# EasyEDA schematic CHARGE MONITORING CIRCUIT.json
TITLE: BATTERY CHARGE MONITORING SYSTEM; REV: 1.0; Date: 2024-02-06; Sheet: 1/1; Drawn By: magambomaurice93; Company: FINALYEAR PROJECT
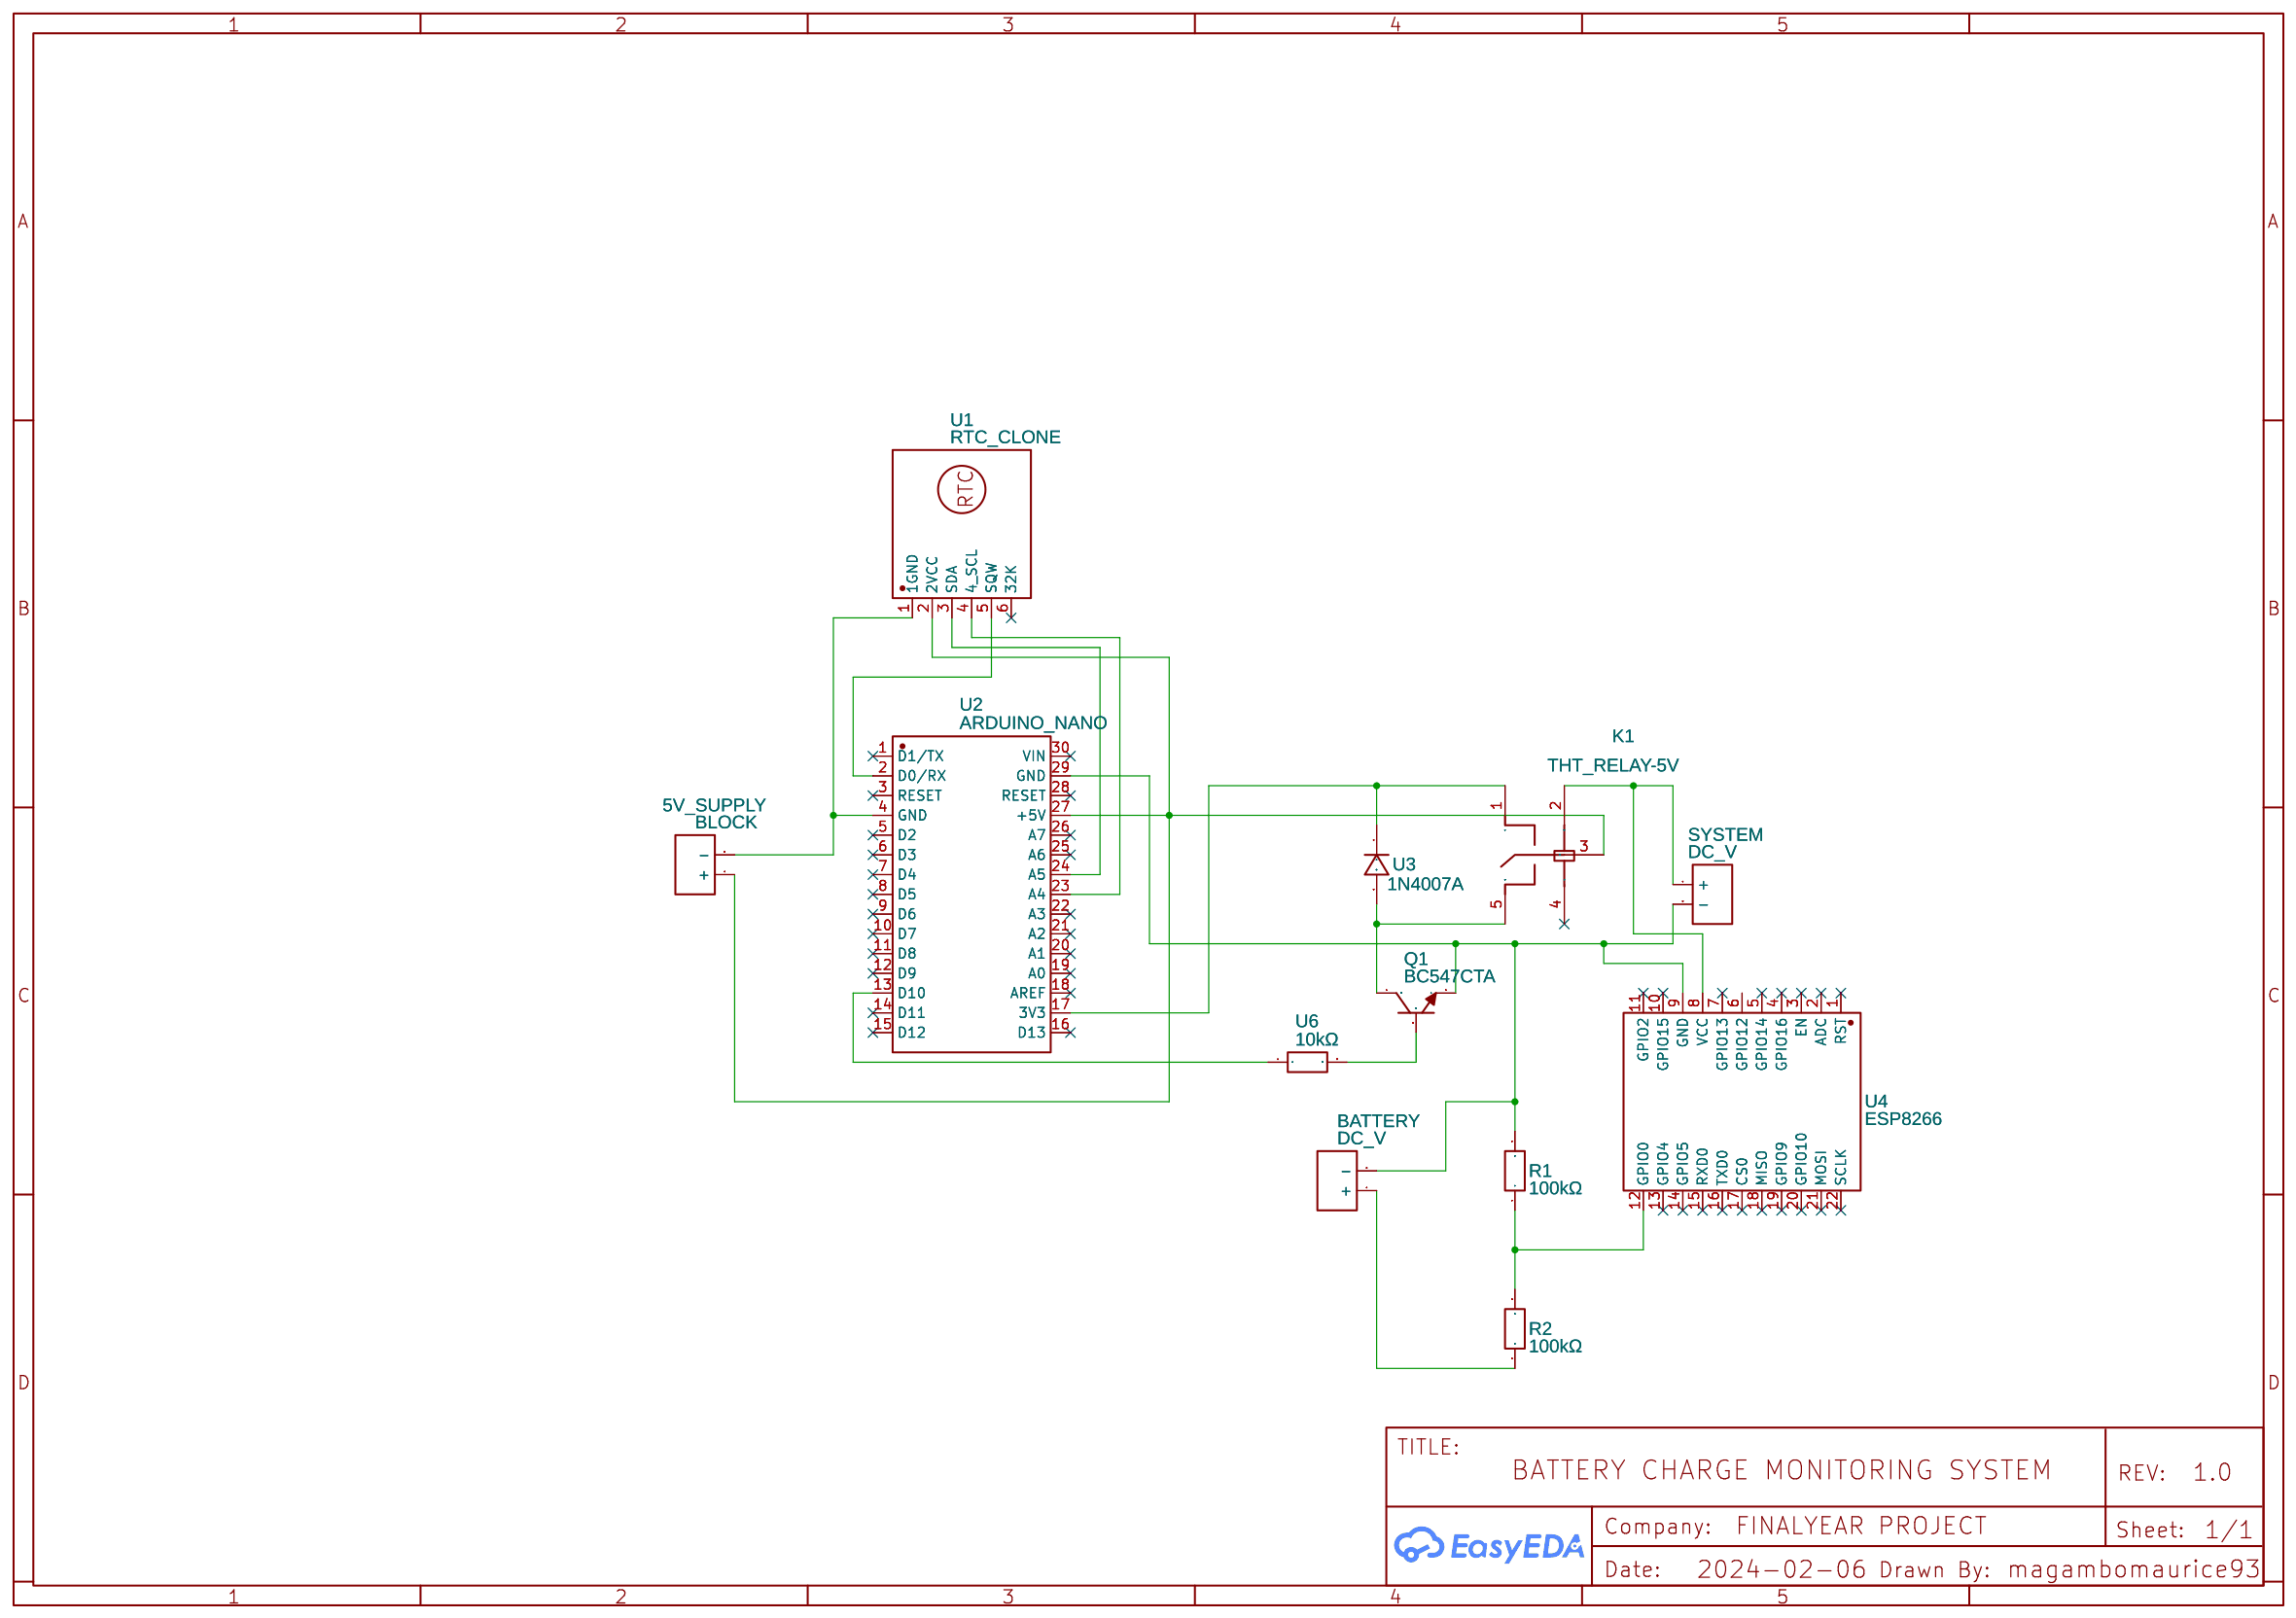
[diagram p0: schematic sheet]

## Parts
5V_SUPPLY  BLOCK  [BORNERA DOS TERMINALES TERMINAL BLOCK 5MM]
BATTERY  DC_V  [BORNERA DOS TERMINALES TERMINAL BLOCK 5MM]
K1  THT_RELAY-5V  [RELAY-TH_RELAY-SPST]
Q1  BC547CTA  [TO-92-3_L4.8-W3.7-P2.54-L]
R1  100kΩ  [RES-TH_BD2.4-L6.3-P10.30-D0.6]
R2  100kΩ  [RES-TH_BD2.4-L6.3-P10.30-D0.6]
SYSTEM  DC_V  [BORNERA DOS TERMINALES TERMINAL BLOCK 5MM]
U1  RTC_CLONE  [RTC3231]
U2  ARDUINO_NANO  [COMM-TH_ARDUINO_NANO]
U3  1N4007A  [DO-41_BD2.4-L4.7-P8.70-D0.9-RD]
U4  ESP8266  [WIFIM-SMD_ESP-12F-ESP8266MOD]
U6  10kΩ  [RES-TH_BD2.4-L6.3-P10.30-D0.6]

## Library data of the parts
5V_SUPPLY BATTERY SYSTEM = DC_V: Contributor: omabistudio
K1 = THT_RELAY-SPST_5V: Supplier: LCSC; Supplier Part: C2941249; Manufacturer: null; Manufacturer Part: Relay-SPST; JLCPCB Part Class: Extended Part; Contributor: aryatama22trm
Q1 = BC547CTA: Contributor: LCSC; Supplier: LCSC; Supplier Part: C900799; Manufacturer: onsemi(安森美); JLCPCB Part Class: Extended Part
R1 R2 = RNF14FAE100K: Contributor: lcsc; Supplier: LCSC; Supplier Part: C2644165; Manufacturer: SEI(Stackpole Electronics Inc.)
U1 = RTC_CLONE: Contributor: James2
U2 = ARDUINO_NANO: Contributor: lcsc; Supplier: LCSC; Supplier Part: C9900017879; Manufacturer: null; JLCPCB Part Class: Extended Part
U3 = 1N4007A: Contributor: lcsc; Supplier: LCSC; Supplier Part: C5336145; Manufacturer: LRC(乐山无线电)
U4 = ESP8266: LINK: https://img.jlc.com/image//data/smt-stock-produce/componentSizePhoto/2021-12-02/b5eb61357b2a478295008aee8c894ebd/BG2111290693_D21112900056_font.png; Contributor: LCSC; Supplier: LCSC; Supplier Part: C9900003049; Manufacturer: null; JLCPCB Part Class: Extended Part
U6 = FM0207FTE52-10K: Contributor: lcsc; Supplier: LCSC; Supplier Part: C1377488; Manufacturer: YAGEO(国巨); JLCPCB Part Class: Extended Part

## Nets
Net-(5V_SUPPLY-1): 5V_SUPPLY.1(+) K1.3 U1.2(2VCC) U2.27(+5V)
Net-(5V_SUPPLY-2): 5V_SUPPLY.2(-) U1.1(1GND) U2.4(GND)
Net-(BATTERY-1): BATTERY.1(+) R2.1
Net-(BATTERY-2): BATTERY.2(-) Q1.3(E) R1.2 SYSTEM.2(-) U2.29(GND) U4.9(GND)
Net-(K1-1): K1.1 U2.17(3V3) U3.1
Net-(K1-2): K1.2 SYSTEM.1(+) U4.8(VCC)
Net-(K1-5): K1.5 Q1.1(C) U3.2
Net-(Q1-2): Q1.2(B) U6.2
Net-(R1-1): R1.1 R2.2 U4.12(GPIO0)
Net-(U1-3): U1.3(SDA) U2.24(A5)
Net-(U1-4): U1.4(4 SCL) U2.23(A4)
Net-(U1-5): U1.5(SQW) U2.2(D0/RX)
Net-(U2-13): U2.13(D10) U6.1

Not connected (* = marked no-connect by the designer): K1 4*; U1 6(32K)*; U2 1(D1/TX)* 3(RESET)* 5(D2)* 6(D3)* 7(D4)* 8(D5)* 9(D6)* 10(D7)* 11(D8)* 12(D9)* 14(D11)* 15(D12)* 16(D13)* 18(AREF)* 19(A0)* 20(A1)* 21(A2)* 22(A3)* 25(A6)* 26(A7)* 28(RESET)* 30(VIN)*; U4 1(RST)* 2(ADC)* 3(EN)* 4(GPIO16)* 5(GPIO14)* 6(GPIO12) 7(GPIO13)* 10(GPIO15)* 11(GPIO2)* 13(GPIO4)* 14(GPIO5)* 15(RXD0)* 16(TXD0)* 17(CS0)* 18(MISO)* 19(GPIO9)* 20(GPIO10)* 21(MOSI)* 22(SCLK)*
